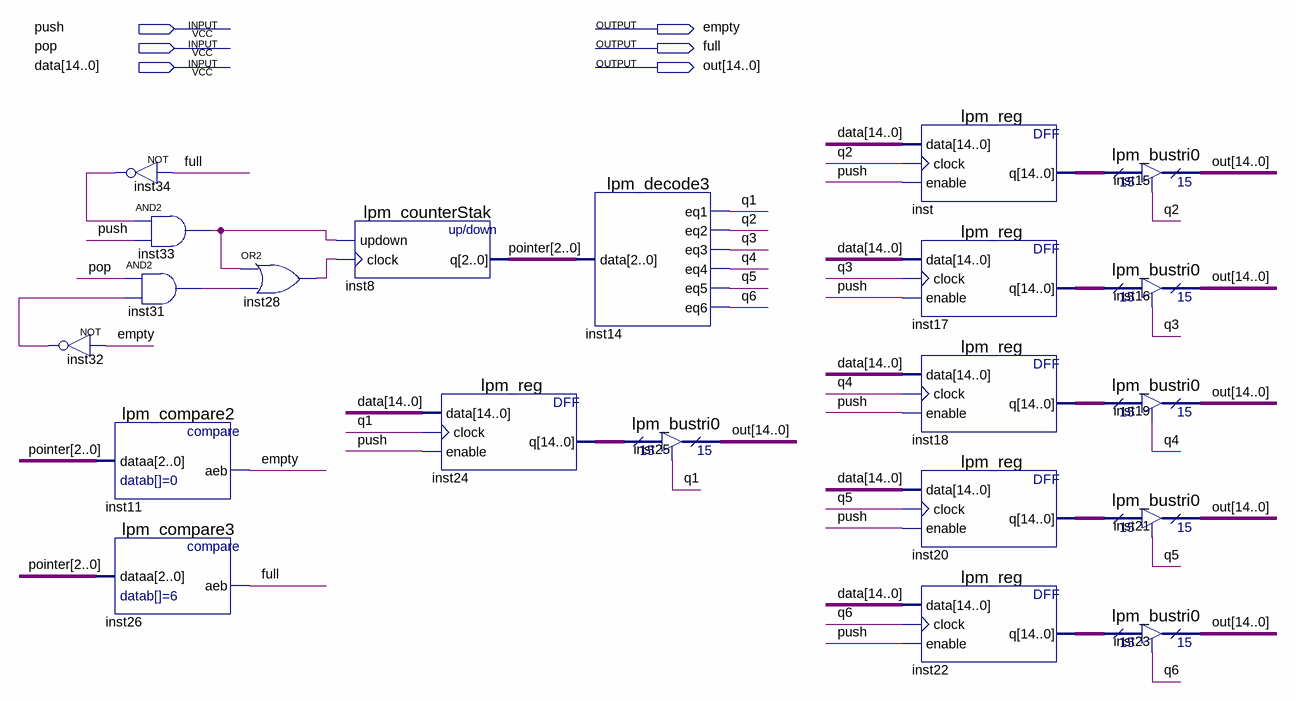
[diagram p0: schematic sheet]
// Quartus schematic stack.bdf as structural Verilog: 21 symbols, 6 pins
module stack (
  input  push,
  input  pop,
  input  [14:0] data,
  output empty,
  output full,
  output [14:0] out
);

  wire inst28_out, inst31_out, inst32_out, inst33_out, inst34_out, q1, q2, q3, q4, q5, q6;
  wire [2:0] pointer;
  wire [14:0] inst17_q, inst18_q, inst20_q, inst22_q, inst24_q, inst_q;

  not inst32 (inst32_out, empty);
  lpm_compare2 inst11 (.dataa(pointer), .aeb(empty));
  lpm_compare3 inst26 (.dataa(pointer), .aeb(full));
  not inst34 (inst34_out, full);
  and inst33 (inst33_out, inst34_out, push);
  and inst31 (inst31_out, pop, inst32_out);
  or inst28 (inst28_out, inst33_out, inst31_out);
  lpm_counterStak inst8 (.updown(inst33_out), .clock(inst28_out), .q(pointer));
  lpm_reg inst24 (.data(data), .clock(q1), .enable(push), .q(inst24_q));
  lpm_decode3 inst14 (.data(pointer), .eq1(q1), .eq2(q2), .eq3(q3), .eq4(q4), .eq5(q5), .eq6(q6));
  lpm_bustri0 inst25 (.enabledt(q1), .data(inst24_q), .tridata(out));
  lpm_reg inst (.data(data), .clock(q2), .enable(push), .q(inst_q));
  lpm_reg inst17 (.data(data), .clock(q3), .enable(push), .q(inst17_q));
  lpm_reg inst18 (.data(data), .clock(q4), .enable(push), .q(inst18_q));
  lpm_reg inst20 (.data(data), .clock(q5), .enable(push), .q(inst20_q));
  lpm_reg inst22 (.data(data), .clock(q6), .enable(push), .q(inst22_q));
  lpm_bustri0 inst15 (.enabledt(q2), .data(inst_q), .tridata(out));
  lpm_bustri0 inst16 (.enabledt(q3), .data(inst17_q), .tridata(out));
  lpm_bustri0 inst19 (.enabledt(q4), .data(inst18_q), .tridata(out));
  lpm_bustri0 inst21 (.enabledt(q5), .data(inst20_q), .tridata(out));
  lpm_bustri0 inst23 (.enabledt(q6), .data(inst22_q), .tridata(out));
endmodule
